# Altium project EDP_new.PrjPcb
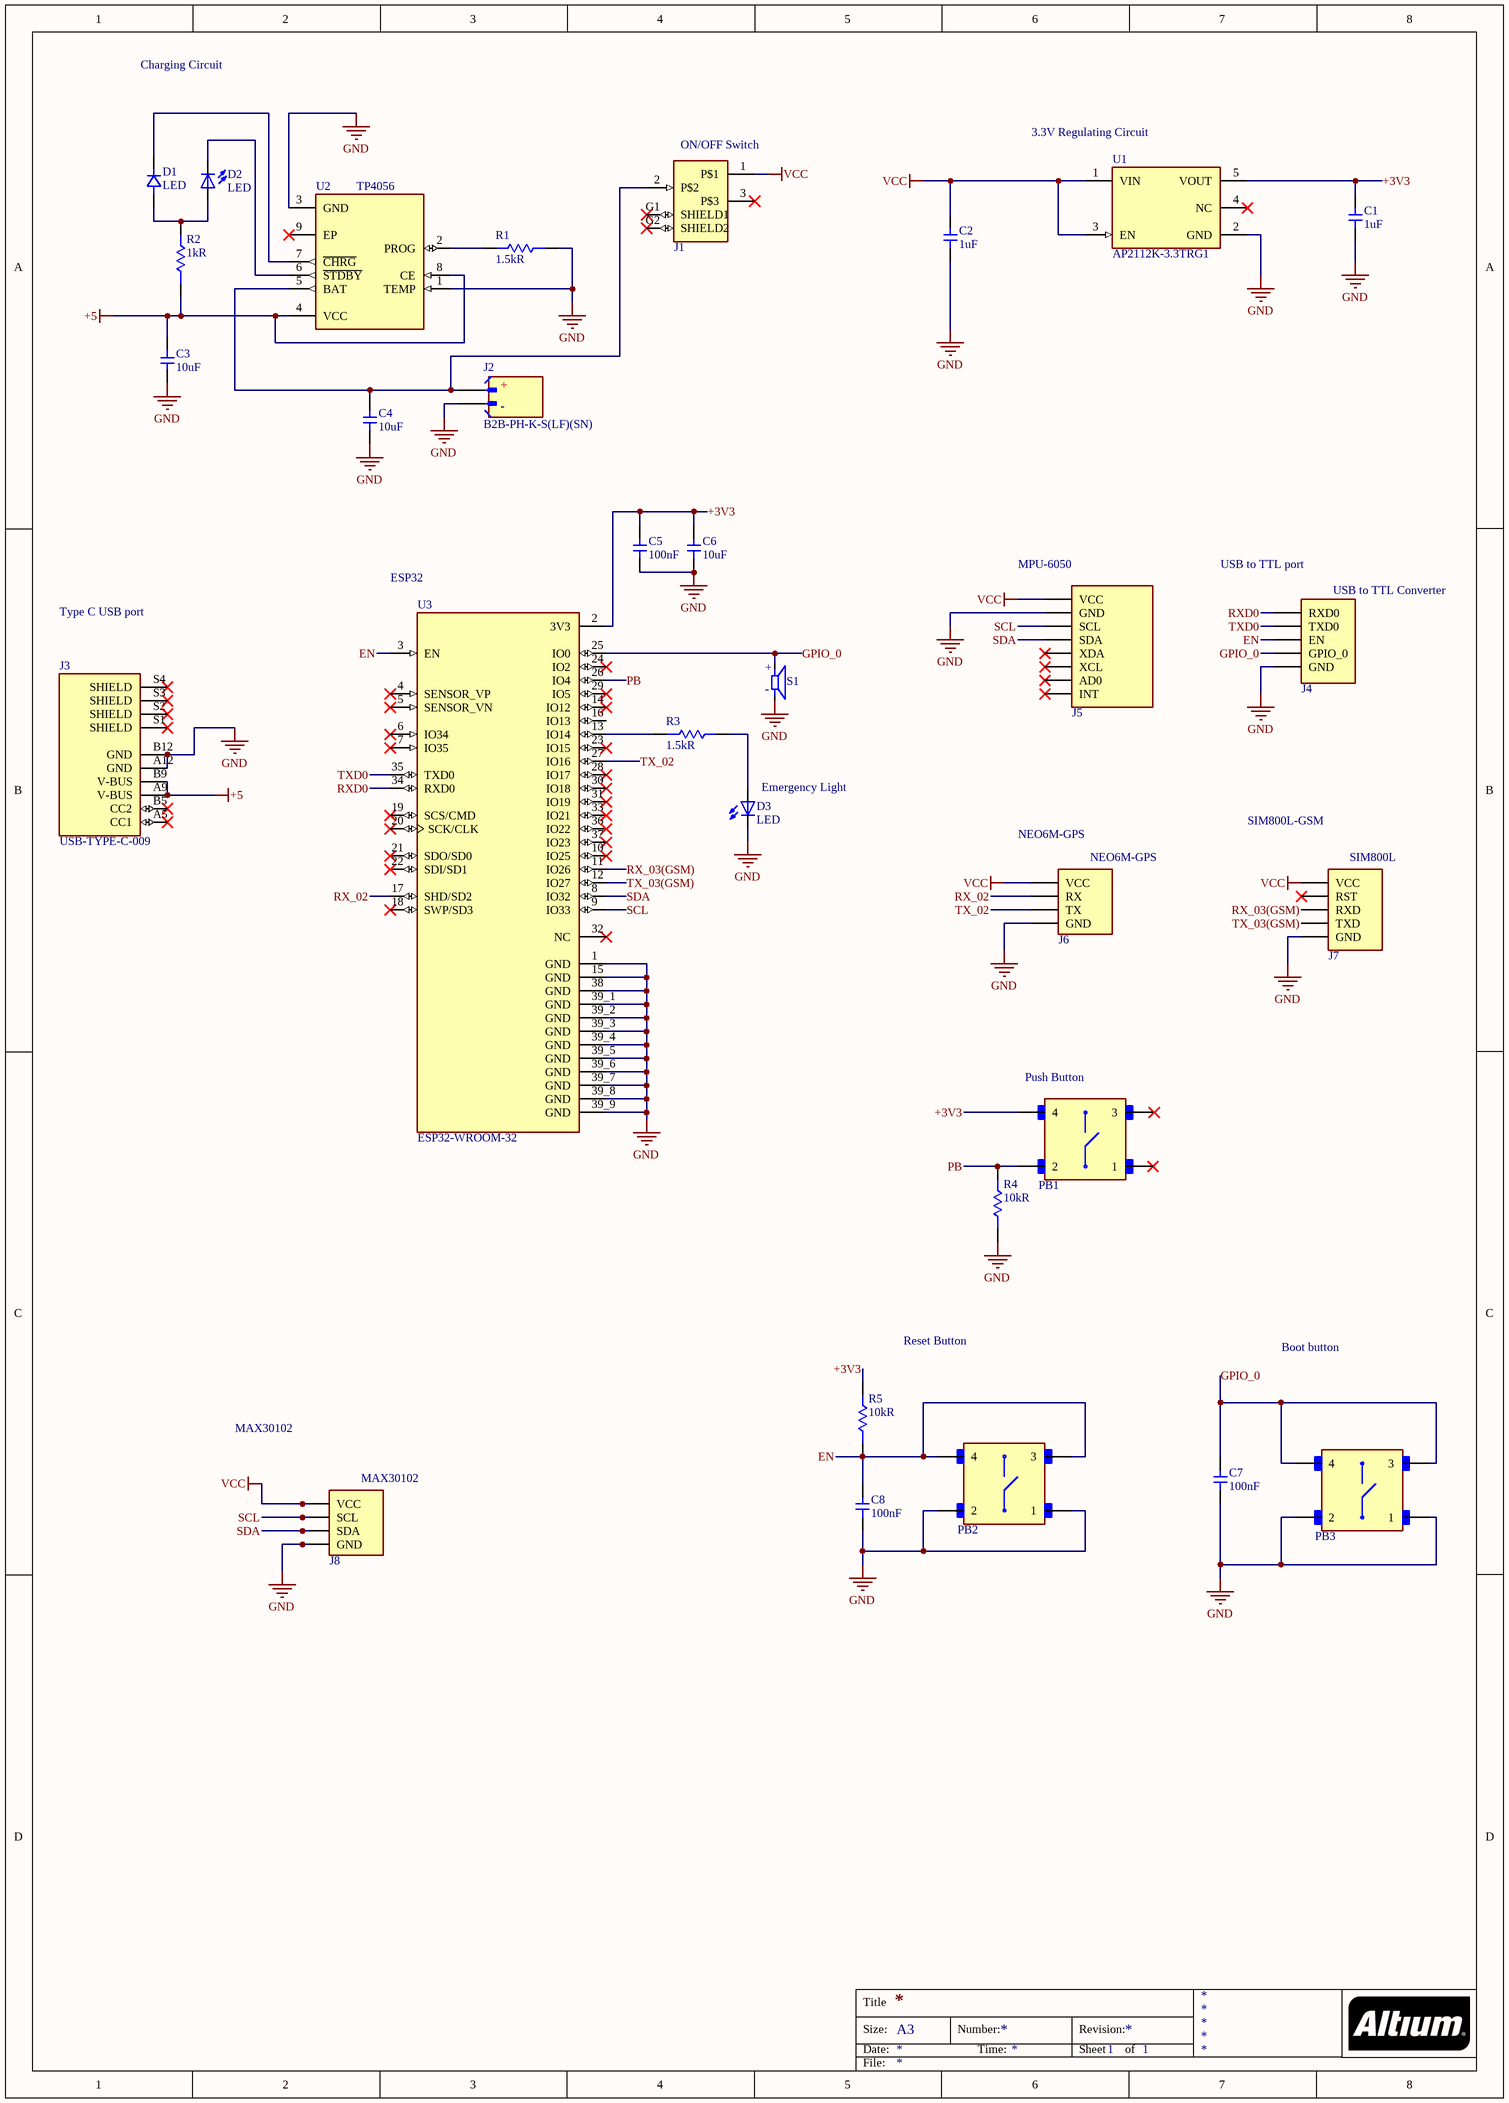
[diagram p0: EDP_new_schematic.SchDoc]
1 sheet, 31 parts. Net scope: global (net labels, ports and power ports of the same name join across sheets).
Board file: EDP_new_pcb.PcbDoc

## Sheet EDP_new_schematic.SchDoc
size A3 portrait; SheetNumber: 1; SheetTotal: 1

### Parts
C1  value 1uF  [C0805C105K4RACTU]  (hidden comment: C0805C105K4RACTU)
C2  value 1uF  [C0805C105K4RACTU]  (hidden comment: C0805C105K4RACTU)
C3  value 10uF  [C0805C106K3PACTU]  (hidden comment: C0805C106K3PACTU)
C4  value 10uF  [C0805C106K3PACTU]  (hidden comment: C0805C106K3PACTU)
C5  value 100nF  [C0805C104K5RACTU]  (hidden comment: C0805C104K5RACTU)
C6  value 10uF  [C0805C106K3PACTU]  (hidden comment: C0805C106K3PACTU)
C7  value 100nF  [C0805C104K5RACTU]  (hidden comment: C0805C104K5RACTU)
C8  value 100nF  [C0805C104K5RACTU]  (hidden comment: C0805C104K5RACTU)
D1  LED  [150080RS75000]
D2  LED  [TLLR4400]
D3  LED  [TLLR4400]
J1  OS102011MA1QN1  [OS102011MA1QN1_connector]  (value not drawn)
J2  Manufacturer Part Number: B2B-PH-K-S(LF)(SN)  [B2B-PH-K-S (LF)(SN)]  (hidden comment: B2B-PH-K-S (LF)(SN))
J3  USB-TYPE-C-009  [USB-TYPE-C-009]
J4  USB-TTL  [USB-TTL]  (value not drawn)
J5  MPU-6050  [MPU-6050]  (value not drawn)
J6  NEO6M-GPS  [NEO6M-GPS]  (value not drawn)
J7  SIM800L  [SIM800L]  (value not drawn)
J8  MAX30102  [MAX30102_connector]  (value not drawn)
PB1  B3F-1000  [SW_B3F-1000]  (value not drawn)
PB2  B3F-1000  [SW_B3F-1000]  (value not drawn)
PB3  B3F-1000  [SW_B3F-1000]  (value not drawn)
R1  value 1.5kR  [RC0805FR-071K5L]  (hidden comment: RC0805FR-071K5L)
R2  value 1kR  [RC0805FR-071KL]  (hidden comment: RC0805FR-071KL)
R3  value 1.5kR  [RC0805FR-071K5L]  (hidden comment: RC0805FR-071K5L)
R4  value 10kR  [RC0805JR-0710KL]  (hidden comment: RC0805JR-0710KL)
R5  value 10kR  [RC0805JR-0710KL]  (hidden comment: RC0805JR-0710KL)
S1  Speaker  [Speaker]  (value not drawn)
U1  AP2112K-3.3TRG1  [FP-SOT25-IPC_A]
U2  TP4056  [TP4056_chip]
U3  ESP32-WROOM-32  [ESP32-WROOM-32_chip]

### Nets
+5: C3.1 J3.A9(V-BUS) J3.B9(V-BUS) R2.1 U2.4(VCC) U2.8(CE)
GND: C1.1 C2.1 C3.2 C4.1 C5.1 C6.1 C7.1 C8.1 D3.K(C) J2.2 J3.A12(GND) J3.B12(GND) J4.05(GND) J5.02(GND) J6.04(GND) J7.05(GND) J8.04(GND) PB2.1 PB2.2 PB3.1 PB3.2 R1.1 R4.1 S1.N U1.2(GND) U2.1(TEMP) U2.3(GND) U3.1(GND) U3.15(GND) U3.38(GND) U3.39_1(GND) U3.39_2(GND) U3.39_3(GND) U3.39_4(GND) U3.39_5(GND) U3.39_6(GND) U3.39_7(GND) U3.39_8(GND) U3.39_9(GND)
VCC: C2.2 J1.1(P$1) J5.01(VCC) J6.01(VCC) J7.01(VCC) J8.01(VCC) U1.1(VIN) U1.3(EN)
+3V3: C1.2 C5.2 C6.2 PB1.4 R5.2 U1.5(VOUT) U3.2(3V3)
EN: C8.2 J4.03(EN) PB2.3 PB2.4 R5.1 U3.3(EN)
GPIO_0: C7.2 J4.04(GPIO_0) PB3.3 PB3.4 S1.P U3.25(IO0)
PB: PB1.2 R4.2 U3.26(IO4)
RX_02: J6.02(RX) U3.17(SHD/SD2)
RX_03(GSM): J7.03(RXD) U3.11(IO26)
RXD0: J4.01(RXD0) U3.34(RXD0)
SCL: J5.03(SCL) J8.02(SCL) U3.9(IO33)
SDA: J5.04(SDA) J8.03(SDA) U3.8(IO32)
TX_02: J6.03(TX) U3.27(IO16)
TX_03(GSM): J7.04(TXD) U3.12(IO27)
TXD0: J4.02(TXD0) U3.35(TXD0)
NetC4_2: C4.2 J1.2(P$2) J2.1 U2.5(BAT)
NetD1_1: D1.1 D2.A R2.2
NetD1_2: D1.2 U2.7(~{CHRG})
NetD2_K: D2.K(C) U2.6(~{STDBY})
NetD3_A: D3.A R3.2
NetR1_2: R1.2 U2.2(PROG)
NetR3_1: R3.1 U3.13(IO14)

Not connected (* = marked no-connect by the designer): J1 3(P$3)* G1(SHIELD1)* G2(SHIELD2)*; J3 A5(CC1)* B5(CC2)* S1(SHIELD)* S2(SHIELD)* S3(SHIELD)* S4(SHIELD)*; J5 05(XDA)* 06(XCL)* 07(AD0)* 08(INT)*; J7 02(RST)*; PB1 1* 3; U1 4(NC)*; U2 9(EP)*; U3 4(SENSOR_VP)* 5(SENSOR_VN)* 6(IO34)* 7(IO35)* 10(IO25)* 14(IO12)* 16(IO13) 18(SWP/SD3)* 19(SCS/CMD)* 20(SCK/CLK)* 21(SDO/SD0)* 22(SDI/SD1)* 23(IO15)* 24(IO2)* 28(IO17)* 29(IO5)* 30(IO18)* 31(IO19)* 32(NC)* 33(IO21)* 36(IO22)* 37(IO23)*

### Notes on the sheet
- Charging Circuit
- (near U1) 3.3V Regulating Circuit
- (near J5) MPU-6050
- (near J4) USB to TTL port
- Type C USB port
- (near U3) ESP32
- (near D3) Emergency Light
- (near J6) NEO6M-GPS
- SIM800L-GSM
- (near PB1) Push Button
- Reset Button
- Boot button
- MAX30102
- Title
- Size:
- Date:
- A3
- Number:
- Time:
- Revision:
- Sheet
- of
- File:
- (in symbol B2B-PH-K-S (LF)(SN)) +; -
- (in symbol OS102011MA1QN1) ON/OFF Switch
- (in symbol Speaker) +; -
- (in symbol USB-TTL) USB to TTL Converter

### Library data of the parts
C1 C2 = C0805C105K4RACTU: Ceramic Capacitor, Multilayer, Ceramic, 16V, 10% +Tol, 10% -Tol, X7R, 15% TC, 1uF, Surface Mount, 0805; Manufacturer: KEMET; Multilayer: Yes; Supplier: Digikey; Supplier Part Number: 399-C0805C105K4RACTUCT-ND; Manufacturer Part Number: C0805C105K4RACTU; RoHS: Yes; Category: Ceramic Capacitors; Stock: 386670; Pricing: 1=0.12, 10=0.068, 100=0.041, 1000=0.03184 (USD); Mounting Technology: Surface Mount; Pins: 2; Dielectric Material: Ceramic; Package Shape: Rectangular; Case/Package: 0805; Terminal Finish: Nickel; Min Operating Temperature: -55°C; Max Operating Temperature: 125°C; JESD-609 Code: e3; Capacitor Type: Ceramic; Tolerance  (fill in as +-): 10%; Packaging: Tape and Reel; Tolerance (fill in as +-): 10%; Rated DC Voltage (URdc): 16V; Temperature Characteristics Code: X7R; Termination: Wraparound; Package Style: SMTMeter; Length: 2mm; Width: 1.25mm; Height: 0.9mm; Reach SVHC Compliant: Yes; RoHS Compliant: Yes; ComponentLink1URL: https://datasheet.ciiva.com:443/pdfs/VipMasterIC/IC/KEME/KEME-S-A0008991654/KEME-S-A0008991654-1.pdf?src-supplier=IHS+Markit; ComponentLink1Description: https://datasheet.ciiva.com:443/pdfs/VipMasterIC/IC/KEME/KEME-S-A0008991654/KEME-S-A0008991654-1.pdf?src-supplier=IHS+Markit; ComponentLink2URL: https://datasheet.ciiva.com/6074/1722731-6074364.pdf?src-supplier=Farnell; ComponentLink2Description: https://datasheet.ciiva.com/6074/1722731-6074364.pdf?src-supplier=Farnell; ComponentLink3URL: https://datasheet.ciiva.com/28692/1851736-28692942.pdf?src-supplier=Element14; ComponentLink3Description: https://datasheet.ciiva.com/28692/1851736-28692942.pdf?src-supplier=Element14; ComponentLink4URL: https://datasheet.ciiva.com/14585/70095383-14585511.pdf?src-supplier=Allied+Electronics; ComponentLink4Description: https://datasheet.ciiva.com/14585/70095383-14585511.pdf?src-supplier=Allied+Electronics; ComponentLink5URL: https://datasheet.ciiva.com/14603/70095383-14603388.pdf?src-supplier=Allied+Electronics; ComponentLink5Description: https://datasheet.ciiva.com/14603/70095383-14603388.pdf?src-supplier=Allied+Electronics; ComponentLink6URL: https://datasheet.ciiva.com/45846/docfinderpartnumberc0402c102k5ractu-45846934.pdf?src-supplier=Onlinecomponents.com; ComponentLink6Description: https://datasheet.ciiva.com/45846/docfinderpartnumberc0402c102k5ractu-45846934.pdf?src-supplier=Onlinecomponents.com
C3 C4 C6 = C0805C106K3PACTU: Ceramic Capacitor, Multilayer, Ceramic, 25V, 10% +Tol, 10% -Tol, X5R, 15% TC, 10uF, Surface Mount, 0805; Manufacturer: KEMET; Multilayer: Yes; Supplier: Digikey; Supplier Part Number: 399-11939-6-ND; Manufacturer Part Number: C0805C106K3PACTU; RoHS: Yes; Category: Ceramic Capacitors; Stock: 59183; Pricing: 1=0.22, 10=0.126, 100=0.0793, 1000=0.05524 (USD); Mounting Technology: Surface Mount; Pins: 2; Dielectric Material: Ceramic; Package Shape: Rectangular; Case/Package: 0805; Terminal Finish: Nickel; Min Operating Temperature: -55°C; Max Operating Temperature: 85°C; JESD-609 Code: e3; Capacitor Type: Ceramic; Tolerance  (fill in as +-): 10%; Packaging: Tape and Reel; Tolerance (fill in as +-): 10%; Rated DC Voltage (URdc): 25V; Temperature Characteristics Code: X5R; Termination: Wraparound; Reach SVHC Compliant: Yes; RoHS Compliant: Yes; ComponentLink1URL: https://datasheet.ciiva.com:443/pdfs/VipMasterIC/IC/KEME/KEME-S-A0008991665/KEME-S-A0008991665-1.pdf?src-supplier=IHS+Markit; ComponentLink1Description: https://datasheet.ciiva.com:443/pdfs/VipMasterIC/IC/KEME/KEME-S-A0008991665/KEME-S-A0008991665-1.pdf?src-supplier=IHS+Markit; ComponentLink2URL: http://www.farnell.com/datasheets/2741185.pdf?src-supplier=Farnell; ComponentLink2Description: http://www.farnell.com/datasheets/2741185.pdf?src-supplier=Farnell; ComponentLink3URL: https://datasheet.octopart.com/C0805C106K3PACTU-KEMET-datasheet-81638446.pdf?src-supplier=Newark; ComponentLink3Description: https://datasheet.octopart.com/C0805C106K3PACTU-KEMET-datasheet-81638446.pdf?src-supplier=Newark; ComponentLink4URL: https://api.kemet.com/component-edge/download/datasheet/C0805C106K3PAC7800.pdf?src-supplier=Digikey; ComponentLink4Description: https://api.kemet.com/component-edge/download/datasheet/C0805C106K3PAC7800.pdf?src-supplier=Digikey; ComponentLink5URL: http://www.farnell.com/datasheets/2741185.pdf?src-supplier=Newark; ComponentLink5Description: http://www.farnell.com/datasheets/2741185.pdf?src-supplier=Newark; ComponentLink6URL: http://www.farnell.com/datasheets/2741185.pdf?src-supplier=Element14; ComponentLink6Description: http://www.farnell.com/datasheets/2741185.pdf?src-supplier=Element14; ComponentLink7URL: https://datasheet.octopart.com/C0805C106K3PACTU-Kemet-datasheet-46909776.pdf?src-supplier=Element14; ComponentLink7Description: https://datasheet.octopart.com/C0805C106K3PACTU-Kemet-datasheet-46909776.pdf?src-supplier=Element14
C5 C7 C8 = C0805C104K5RACTU: Ceramic Capacitor, Multilayer, Ceramic, 50V, 10% +Tol, 10% -Tol, X7R, 15% TC, 0.1uF, Surface Mount, 0805; Manufacturer: KEMET; Multilayer: Yes; Supplier: Digikey; Supplier Part Number: 399-C0805C104K5RACTUTR-ND; Manufacturer Part Number: C0805C104K5RACTU; RoHS: Yes; Category: Ceramic Capacitors; Stock: 495390; Pricing: 4000=0.0224, 8000=0.016, 12000=0.0148 (USD); Mounting Technology: Surface Mount; Pins: 2; Dielectric Material: Ceramic; Package Shape: Rectangular; Case/Package: 0805; Terminal Finish: Nickel; Min Operating Temperature: -55°C; Max Operating Temperature: 125°C; JESD-609 Code: e3; Capacitor Type: Ceramic; Tolerance  (fill in as +-): 10%; Package Style: SMTMeter; Packaging: Tape and Reel; Tolerance (fill in as +-): 10%; Rated DC Voltage (URdc): 50V; Temperature Characteristics Code: X7R; Termination: Wraparound; Length: 2mm; Width: 1.25mm; Height: 0.78mm; Reach SVHC Compliant: Yes; RoHS Compliant: Yes; ComponentLink1URL: https://datasheet.ciiva.com:443/pdfs/VipMasterIC/IC/KEME/KEME-S-A0008991654/KEME-S-A0008991654-1.pdf?src-supplier=IHS+Markit; ComponentLink1Description: https://datasheet.ciiva.com:443/pdfs/VipMasterIC/IC/KEME/KEME-S-A0008991654/KEME-S-A0008991654-1.pdf?src-supplier=IHS+Markit; ComponentLink2URL: https://datasheet.ciiva.com/32431/slceramic-chip-condensers-e-32431755.pdf?src-supplier=Distrelec; ComponentLink2Description: https://datasheet.ciiva.com/32431/slceramic-chip-condensers-e-32431755.pdf?src-supplier=Distrelec; ComponentLink3URL: https://datasheet.ciiva.com/28682/1851736-28682232.pdf?src-supplier=Element14; ComponentLink3Description: https://datasheet.ciiva.com/28682/1851736-28682232.pdf?src-supplier=Element14; ComponentLink4URL: https://datasheet.ciiva.com/18410/70095383-18410815.pdf?src-supplier=Allied+Electronics; ComponentLink4Description: https://datasheet.ciiva.com/18410/70095383-18410815.pdf?src-supplier=Allied+Electronics; ComponentLink5URL: https://datasheet.ciiva.com/14589/70095383-14589048.pdf?src-supplier=Allied+Electronics; ComponentLink5Description: https://datasheet.ciiva.com/14589/70095383-14589048.pdf?src-supplier=Allied+Electronics
D1 = 150080RS75000: Single Color LED, Red, Water Clear, 1.4mm; Manufacturer: Wurth Electronics; Shape: Rectangular; Forward Current: 30mA; Luminous Intensity-Nom: 150mcd; Channels: 1; Viewing Angle: 140°; Overall Height: 0.7mm; Supplier: Digikey; Supplier Part Number: 732-4984-1-ND; Manufacturer Part Number: 150080RS75000; RoHS: Yes; Category: LEDs; Stock: 56216; Pricing: 1=0.19, 50=0.176, 100=0.151, 500=0.14688 (USD); Mounting Technology: Surface Mount; Pins: 2; Color: Red; Min Operating Temperature: -40°C; Max Operating Temperature: 85°C; Lens Style: WATER CLEAR; Optoelectronic Device Type: SINGLE COLOR LED; Packaging: Tape and Reel; Size: 1.4mm; Terminal Pitch: 2.1mm; Reach SVHC Compliant: Yes; RoHS Compliant: Yes; ComponentLink1URL: https://datasheet.ciiva.com:443/pdfs/VipMasterIC/IC/MIDC/MIDC-S-A0007455974/MIDC-S-A0007455974-1.pdf?src-supplier=IHS+Markit; ComponentLink1Description: https://datasheet.ciiva.com:443/pdfs/VipMasterIC/IC/MIDC/MIDC-S-A0007455974/MIDC-S-A0007455974-1.pdf?src-supplier=IHS+Markit; ComponentLink2URL: https://datasheet.ciiva.com/22656/150080rs75000-22656961.pdf?src-supplier=Element14; ComponentLink2Description: https://datasheet.ciiva.com/22656/150080rs75000-22656961.pdf?src-supplier=Element14; ComponentLink3URL: https://datasheet.ciiva.com/29279/759435-da-01-en-chipled-0805-w-kl-rot-150080rs75000-29279032.pdf?src-supplier=Conrad; ComponentLink3Description: https://datasheet.ciiva.com/29279/759435-da-01-en-chipled-0805-w-kl-rot-150080rs75000-29279032.pdf?src-supplier=Conrad
D2 D3 = TLLR4400: LED; Red; 1.2mcd; 3.2mmDia.; T-1; 7mA; 1.9V; 635nm; +/-25deg; GaAsP on GaP; 15V; Manufacturer: Vishay; Supplier: Arrow Electronics; Supplier Part Number: TLLR4400; Manufacturer Part Number: TLLR4400; RoHS: No; Category: LEDs; Stock: 6346; Pricing: 1=0.4975, 10=0.3483, 100=0.26, 500=0.2194, 1000=0.2024, 5000=0.19, 10000=0.156, 25000=0.1526 (USD); ComponentLink1URL: https://datasheet.ciiva.com/11774/0900766b80e22d14-11774062.pdf?src-supplier=Rs; ComponentLink1Description: https://datasheet.ciiva.com/11774/0900766b80e22d14-11774062.pdf?src-supplier=Rs
J2 = B2B-PH-K-S (LF)(SN): Board Connector, 2 Contact(s), 1 Row(s), Male, Straight, 0.079 inch Pitch, Solder Terminal, Locking, Natural Insulator; Manufacturer: JST; Supplier: Arrow Electronics; Supplier Part Number: B2B-PH-K-S(LF)(SN); RoHS: Yes; Category: Headers and Wire Housings; Stock: 109655; Pricing: 1=0.1137, 10=0.0604, 25=0.0597, 100=0.0592, 500=0.0585, 1000=0.0562 (USD); ComponentLink1URL: https://datasheet.ciiva.com:443/pdfs/VipMasterIC/IC/JSTM/JSTM-S-A0007943211/JSTM-S-A0007943211-1.pdf?src-supplier=IHS+Markit; ComponentLink1Description: https://datasheet.ciiva.com:443/pdfs/VipMasterIC/IC/JSTM/JSTM-S-A0007943211/JSTM-S-A0007943211-1.pdf?src-supplier=IHS+Markit; ComponentLink2URL: https://datasheet.ciiva.com/11746/0900766b8082f551-11746676.pdf?src-supplier=Rs; ComponentLink2Description: https://datasheet.ciiva.com/11746/0900766b8082f551-11746676.pdf?src-supplier=Rs; ComponentLink3URL: https://datasheet.ciiva.com/16422/b2b-ph-k-slfsn-16422715.pdf?src-supplier=Future+Electronics; ComponentLink3Description: https://datasheet.ciiva.com/16422/b2b-ph-k-slfsn-16422715.pdf?src-supplier=Future+Electronics
J5 = MPU-6050: Board Stacking Connector, 14 Contact(s), 1 Row(s), Male, Straight, Solder Terminal; Manufacturer: Samtec; Manufacturer Part Number: MTLW-114-07-T-S-235; Option: General Purpose; Filter Feature: No; Number of Rows Loaded: 1; Number of Contacts: 14; Supplier: Digikey; Supplier Part Number: 612-MTLW-114-07-T-S-235-ND; RoHS: Yes; Category: Connectors; Pricing: 1=1.97 (USD); Mounting Technology: Board; Connector Type: BOARD STACKING CONNECTOR; Contact Gender: Male; Mixed Contacts: No; Mounting Style: STRAIGHT; Termination: Solder; Terminal Pitch: 2.54mm; Flammability Rating: UL94 V-0; DIN Conformance: No; IEC Conformance: No; MIL Conformance: No; Reach SVHC Compliant: Yes; RoHS Compliant: Yes; ComponentLink1URL: https://datasheet.ciiva.com:443/pdfs/VipMasterIC/IC/SAMI/SAMI-S-A0001769147/SAMI-S-A0001769147-1.pdf?src-supplier=IHS+Markit; ComponentLink1Description: https://datasheet.ciiva.com:443/pdfs/VipMasterIC/IC/SAMI/SAMI-S-A0001769147/SAMI-S-A0001769147-1.pdf?src-supplier=IHS+Markit; ComponentLink2URL: https://datasheet.ciiva.com/10029/mtlw-th-10029781.pdf?src-supplier=Avnet; ComponentLink2Description: https://datasheet.ciiva.com/10029/mtlw-th-10029781.pdf?src-supplier=Avnet
R1 R3 = RC0805FR-071K5L: Fixed Resistor, Metal Glaze/thick Film, 0.125W, 1500ohm, 150V, 1% +/-Tol, 100ppm/Cel, Surface Mount, 0805; Manufacturer: Yageo; Additional Feature: LASER TRIMMABLE; Power: 125mW; Rated Temperature: 70°C; Temperature Coefficient (ppm/Cel): 100; Package Height: 0.5mm; Package Length: 2mm; Package Width: 1.25mm; Supplier: Digikey; Supplier Part Number: 311-1.50KCRCT-ND; Manufacturer Part Number: RC0805FR-071K5L; RoHS: Yes; Category: Chip SMD Resistors; Stock: 226709; Pricing: 1=0.1, 10=0.012, 100=0.0112, 1000=0.00918, 2500=0.00686 (USD); Mounting Technology: Surface Mount; Pins: 2; Package Shape: Rectangular; Case/Package: 0805; Terminal Finish: Nickel; Min Operating Temperature: -55°C; Max Operating Temperature: 155°C; Tolerance: 1%; JESD-609 Code: e3; Termination: Wraparound; Resistor Type: FIXED RESISTOR; Construction: Chip; Packaging: Tape and Reel; Technology: METAL GLAZE/THICK FILM; Working Voltage: 150V; Reach SVHC Compliant: Yes; RoHS Compliant: Yes; ComponentLink1URL: https://datasheet.ciiva.com:443/pdfs/VipMasterIC/IC/YAGO/YAGO-S-A0008145938/YAGO-S-A0008145938-1.pdf?src-supplier=IHS+Markit; ComponentLink1Description: https://datasheet.ciiva.com:443/pdfs/VipMasterIC/IC/YAGO/YAGO-S-A0008145938/YAGO-S-A0008145938-1.pdf?src-supplier=IHS+Markit; ComponentLink2URL: https://datasheet.ciiva.com/17423/rc0805-17423247.pdf?src-supplier=Future+Electronics; ComponentLink2Description: https://datasheet.ciiva.com/17423/rc0805-17423247.pdf?src-supplier=Future+Electronics
R2 = RC0805FR-071KL: Fixed Resistor, Metal Glaze/thick Film, 0.125W, 1000ohm, 150V, 1% +/-Tol, 100ppm/Cel, Surface Mount, 0805; Manufacturer: Yageo; Additional Feature: LASER TRIMMABLE; Power: 125mW; Rated Temperature: 70°C; Temperature Coefficient (ppm/Cel): 100; Package Height: 0.5mm; Package Length: 2mm; Package Width: 1.25mm; Supplier: Digikey; Supplier Part Number: 311-1.00KCRTR-ND; Manufacturer Part Number: RC0805FR-071KL; RoHS: Yes; Category: Chip SMD Resistors; Stock: 465000; Pricing: 5000=0.00408, 10000=0.00396, 15000=0.00374, 25000=0.00356 (USD); Mounting Technology: Surface Mount; Pins: 2; Package Shape: Rectangular; Case/Package: 0805; Terminal Finish: Nickel; Min Operating Temperature: -55°C; Max Operating Temperature: 155°C; Tolerance: 1%; JESD-609 Code: e3; Termination: Wraparound; Resistor Type: FIXED RESISTOR; Construction: Chip; Packaging: Tape and Reel; Technology: METAL GLAZE/THICK FILM; Working Voltage: 150V; Reach SVHC Compliant: Yes; RoHS Compliant: Yes; ComponentLink1URL: https://datasheet.ciiva.com:443/pdfs/VipMasterIC/IC/YAGO/YAGO-S-A0008145938/YAGO-S-A0008145938-1.pdf?src-supplier=IHS+Markit; ComponentLink1Description: https://datasheet.ciiva.com:443/pdfs/VipMasterIC/IC/YAGO/YAGO-S-A0008145938/YAGO-S-A0008145938-1.pdf?src-supplier=IHS+Markit; ComponentLink2URL: https://datasheet.ciiva.com/7941/1686128-7941719.pdf?src-supplier=Element14; ComponentLink2Description: https://datasheet.ciiva.com/7941/1686128-7941719.pdf?src-supplier=Element14; ComponentLink3URL: https://datasheet.ciiva.com/46385/444164-46385020.pdf?src-supplier=Element14; ComponentLink3Description: https://datasheet.ciiva.com/46385/444164-46385020.pdf?src-supplier=Element14; ComponentLink4URL: https://datasheet.ciiva.com/2456/pyu-r-int-thick-7-2456976.pdf?src-supplier=Digikey; ComponentLink4Description: https://datasheet.ciiva.com/2456/pyu-r-int-thick-7-2456976.pdf?src-supplier=Digikey; ComponentLink5URL: https://datasheet.ciiva.com/2456/pyu-r-int-thick-7-2456977.pdf?src-supplier=Digikey; ComponentLink5Description: https://datasheet.ciiva.com/2456/pyu-r-int-thick-7-2456977.pdf?src-supplier=Digikey; ComponentLink6URL: https://datasheet.ciiva.com/2456/pyu-r-int-thick-7-2456975.pdf?src-supplier=Digikey; ComponentLink6Description: https://datasheet.ciiva.com/2456/pyu-r-int-thick-7-2456975.pdf?src-supplier=Digikey; ComponentLink7URL: https://datasheet.ciiva.com/16850/rc0805-16850409.pdf?src-supplier=Future+Electronics; ComponentLink7Description: https://datasheet.ciiva.com/16850/rc0805-16850409.pdf?src-supplier=Future+Electronics
R4 R5 = RC0805JR-0710KL: Fixed Resistor, Metal Glaze/thick Film, 0.125W, 10000ohm, 150V, 5% +/-Tol, 100ppm/Cel, Surface Mount, 0805; Manufacturer: Yageo; Additional Feature: LASER TRIMMABLE; Power: 125mW; Rated Temperature: 70°C; Temperature Coefficient (ppm/Cel): 100; Package Height: 0.5mm; Package Length: 2mm; Package Width: 1.25mm; Supplier: Avnet; Supplier Part Number: 80K7383; Manufacturer Part Number: RC0805JR-0710KL; RoHS: Yes; Category: Chip SMD Resistors; Stock: 270; Pricing: 1=0.014, 30=0.011, 50=0.01, 100=0.008 (USD); Mounting Technology: Surface Mount; Pins: 2; Package Shape: Rectangular; Case/Package: 0805; Terminal Finish: Nickel; Min Operating Temperature: -55°C; Max Operating Temperature: 155°C; Tolerance: 5%; JESD-609 Code: e3; Resistor Type: FIXED RESISTOR; Construction: Chip; Packaging: Tape and Reel; Technology: METAL GLAZE/THICK FILM; Termination: Wraparound; Working Voltage: 150V; Reach SVHC Compliant: Yes; RoHS Compliant: Yes; ComponentLink1URL: https://datasheet.ciiva.com:443/pdfs/VipMasterIC/IC/YAGO/YAGO-S-A0008145938/YAGO-S-A0008145938-1.pdf?src-supplier=IHS+Markit; ComponentLink1Description: https://datasheet.ciiva.com:443/pdfs/VipMasterIC/IC/YAGO/YAGO-S-A0008145938/YAGO-S-A0008145938-1.pdf?src-supplier=IHS+Markit; ComponentLink2URL: https://datasheet.ciiva.com/7983/444164-7983765.pdf?src-supplier=Element14; ComponentLink2Description: https://datasheet.ciiva.com/7983/444164-7983765.pdf?src-supplier=Element14; ComponentLink3URL: https://datasheet.ciiva.com/7941/444164-7941870.pdf?src-supplier=Element14; ComponentLink3Description: https://datasheet.ciiva.com/7941/444164-7941870.pdf?src-supplier=Element14; ComponentLink4URL: https://datasheet.ciiva.com/7941/444164-7941871.pdf?src-supplier=Element14; ComponentLink4Description: https://datasheet.ciiva.com/7941/444164-7941871.pdf?src-supplier=Element14
U1 = CMP-12756-000035-1: IC REG LINEAR 3.3V 600MA SOT25; Number of Regulators: 1; Output Type: Fixed; Polarity: Positive; Min Input Voltage: 2.5V; Max Input Voltage: 6V; Accuracy: 1.5%; Quiescent Current: 55uA; Dropout Voltage: 250mV; Min Operating Temperature: -40°C; Length: 3.1mm; Output Current: 600mA; Max Operating Temperature: 85°C; Package Quantity: 1; Output Voltage: 3.3V; Width: 1.7mm; Number of Outputs: 1; Packaging: Tape and Reel; Height: 1.3mm; Lead Free: Lead Free; Max Output Current: 600mA; Case/Package: SOT-23-5; Mount: Surface Mount; Number of Pins: 5
U2 = TP4056_chip
U3 = ESP32-WROOM-32: Bluetooth, WiFi 802.11b/g/n, Bluetooth v4.2 +EDR, Class 1, 2 and 3 Transceiver Module 2.4GHz ~ 2.5GHz Antenna Not Included, U.FL Surface Mount